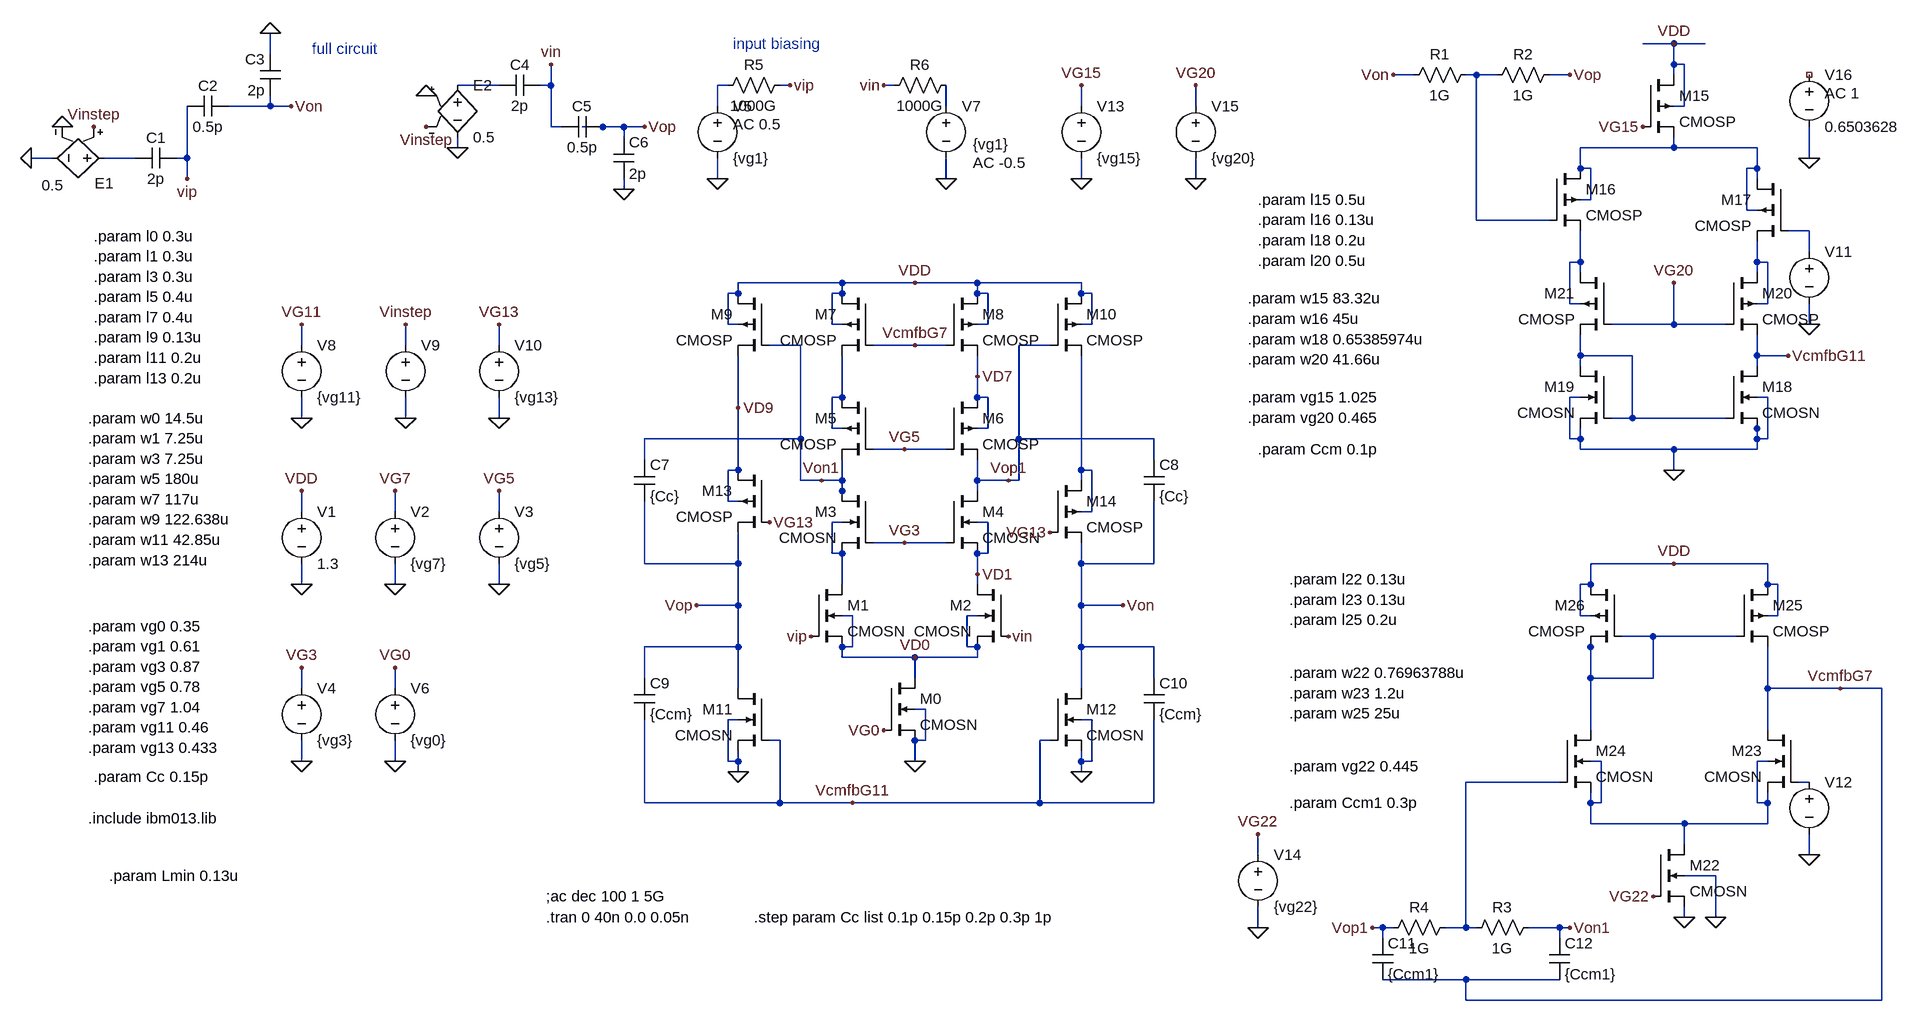
[diagram p0: schematic assignment5_final.asc]
assignment5_final.asc, the LTspice schematic file:
Version 4
SHEET 1 2248 764
WIRE 1360 -800 1312 -800
WIRE 1408 -800 1360 -800
WIRE -800 -784 -800 -816
WIRE 1360 -768 1360 -800
WIRE 1376 -768 1360 -768
WIRE 960 -752 928 -752
WIRE 1056 -752 1040 -752
WIRE 1088 -752 1056 -752
WIRE 1200 -752 1168 -752
WIRE 1360 -752 1360 -768
WIRE -448 -736 -512 -736
WIRE -368 -736 -368 -768
WIRE -368 -736 -384 -736
WIRE -96 -736 -112 -736
WIRE 0 -736 -16 -736
WIRE 160 -736 144 -736
WIRE -800 -704 -800 -720
WIRE -800 -704 -864 -704
WIRE -768 -704 -800 -704
WIRE -112 -704 -112 -736
WIRE 240 -704 240 -736
WIRE 448 -704 448 -736
WIRE 624 -704 624 -736
WIRE 1376 -704 1376 -768
WIRE 1376 -704 1360 -704
WIRE -368 -672 -368 -736
WIRE -352 -672 -368 -672
WIRE -288 -672 -320 -672
WIRE -256 -672 -288 -672
WIRE -224 -672 -256 -672
WIRE -256 -656 -256 -672
WIRE -512 -640 -512 -656
WIRE 1360 -640 1360 -656
WIRE 1360 -640 1216 -640
WIRE 1488 -640 1360 -640
WIRE -1136 -624 -1168 -624
WIRE -1008 -624 -1056 -624
WIRE -928 -624 -928 -704
WIRE -928 -624 -944 -624
WIRE 1568 -624 1568 -672
WIRE 1216 -608 1216 -640
WIRE 1232 -608 1216 -608
WIRE 1488 -608 1488 -640
WIRE 1488 -608 1472 -608
WIRE -928 -592 -928 -624
WIRE -112 -592 -112 -624
WIRE 240 -592 240 -624
WIRE 448 -592 448 -624
WIRE 624 -592 624 -624
WIRE 1488 -592 1488 -608
WIRE -256 -576 -256 -592
WIRE 1232 -560 1232 -608
WIRE 1232 -560 1216 -560
WIRE 1472 -544 1472 -608
WIRE 1488 -544 1472 -544
WIRE 1056 -528 1056 -752
WIRE 1168 -528 1056 -528
WIRE 1568 -512 1536 -512
WIRE 1568 -480 1568 -512
WIRE 1216 -464 1216 -512
WIRE 1216 -464 1200 -464
WIRE 1488 -464 1488 -496
WIRE 1504 -464 1488 -464
WIRE 1216 -448 1216 -464
WIRE 1488 -448 1488 -464
WIRE 80 -432 -80 -432
WIRE 192 -432 80 -432
WIRE 288 -432 192 -432
WIRE 448 -432 288 -432
WIRE -80 -416 -80 -432
WIRE -80 -416 -96 -416
WIRE 80 -416 80 -432
WIRE 80 -416 64 -416
WIRE 288 -416 288 -432
WIRE 304 -416 288 -416
WIRE 448 -416 448 -432
WIRE 464 -416 448 -416
WIRE 1200 -400 1200 -464
WIRE 1216 -400 1200 -400
WIRE 1504 -400 1504 -464
WIRE 1504 -400 1488 -400
WIRE -96 -368 -96 -416
WIRE -80 -368 -96 -368
WIRE 64 -368 64 -416
WIRE 80 -368 64 -368
WIRE 304 -368 304 -416
WIRE 304 -368 288 -368
WIRE 464 -368 464 -416
WIRE 464 -368 448 -368
WIRE 1360 -368 1360 -432
WIRE 1360 -368 1264 -368
WIRE 1440 -368 1360 -368
WIRE 1568 -368 1568 -400
WIRE -752 -336 -752 -368
WIRE -592 -336 -592 -368
WIRE -448 -336 -448 -368
WIRE 16 -336 -32 -336
WIRE 192 -336 128 -336
WIRE 240 -336 192 -336
WIRE 400 -336 352 -336
WIRE 1216 -320 1216 -352
WIRE 1296 -320 1216 -320
WIRE 1488 -320 1488 -352
WIRE 1536 -320 1488 -320
WIRE 1216 -304 1216 -320
WIRE 1488 -304 1488 -320
WIRE 288 -288 288 -320
WIRE 80 -256 80 -320
WIRE 80 -256 64 -256
WIRE 288 -256 288 -288
WIRE 304 -256 288 -256
WIRE 1216 -256 1200 -256
WIRE 1504 -256 1488 -256
WIRE -80 -240 -80 -320
WIRE -752 -224 -752 -256
WIRE -592 -224 -592 -256
WIRE -448 -224 -448 -256
WIRE 1296 -224 1296 -320
WIRE 1296 -224 1264 -224
WIRE 1440 -224 1296 -224
WIRE 64 -208 64 -256
WIRE 80 -208 64 -208
WIRE 304 -208 304 -256
WIRE 304 -208 288 -208
WIRE 1488 -208 1488 -224
WIRE 16 -192 16 -336
WIRE 16 -192 -224 -192
WIRE 352 -192 352 -336
WIRE 560 -192 352 -192
WIRE 1200 -192 1200 -256
WIRE 1216 -192 1216 -208
WIRE 1216 -192 1200 -192
WIRE 1488 -192 1488 -208
WIRE 1504 -192 1504 -256
WIRE 1504 -192 1488 -192
WIRE 176 -176 128 -176
WIRE 240 -176 176 -176
WIRE 1216 -176 1216 -192
WIRE 1360 -176 1216 -176
WIRE 1488 -176 1488 -192
WIRE 1488 -176 1360 -176
WIRE -224 -160 -224 -192
WIRE 560 -160 560 -192
WIRE -80 -144 -80 -240
WIRE -80 -144 -96 -144
WIRE 448 -144 448 -320
WIRE 464 -144 448 -144
WIRE 1360 -144 1360 -176
WIRE 16 -128 16 -192
WIRE 48 -128 16 -128
WIRE 80 -128 80 -160
WIRE 80 -128 48 -128
WIRE 288 -128 288 -160
WIRE 336 -128 288 -128
WIRE 352 -128 352 -192
WIRE 352 -128 336 -128
WIRE 448 -128 448 -144
WIRE 80 -112 80 -128
WIRE 288 -112 288 -128
WIRE -96 -96 -96 -144
WIRE -80 -96 -96 -96
WIRE 80 -96 80 -112
WIRE -752 -80 -752 -112
WIRE -608 -80 -608 -112
WIRE -448 -80 -448 -112
WIRE 464 -80 464 -144
WIRE 464 -80 448 -80
WIRE 80 -64 64 -64
WIRE 304 -64 288 -64
WIRE 176 -32 128 -32
WIRE 240 -32 176 -32
WIRE 64 -16 64 -64
WIRE 80 -16 64 -16
WIRE 304 -16 304 -64
WIRE 304 -16 288 -16
WIRE -224 0 -224 -96
WIRE -80 0 -80 -48
WIRE -80 0 -224 0
WIRE 448 0 448 -32
WIRE 560 0 560 -96
WIRE 560 0 448 0
WIRE 1360 0 1232 0
WIRE 1504 0 1360 0
WIRE 288 16 288 -16
WIRE -752 32 -752 0
WIRE -608 32 -608 0
WIRE -448 32 -448 0
WIRE 80 32 80 -16
WIRE 288 32 288 16
WIRE 1232 32 1232 0
WIRE 1232 32 1216 32
WIRE 1504 32 1504 0
WIRE 1520 32 1504 32
WIRE -80 64 -80 0
WIRE -80 64 -144 64
WIRE 448 64 448 0
WIRE 512 64 448 64
WIRE 96 80 80 80
WIRE 288 80 272 80
WIRE 1216 80 1216 32
WIRE 1232 80 1216 80
WIRE 1520 80 1520 32
WIRE 1520 80 1504 80
WIRE 1328 112 1280 112
WIRE 1456 112 1328 112
WIRE -80 128 -80 64
WIRE -80 128 -224 128
WIRE 96 128 96 80
WIRE 96 128 80 128
WIRE 272 128 272 80
WIRE 288 128 272 128
WIRE 448 128 448 64
WIRE 560 128 448 128
WIRE 1232 128 1232 112
WIRE 80 144 80 128
WIRE 192 144 80 144
WIRE 288 144 288 128
WIRE 288 144 192 144
WIRE -224 176 -224 128
WIRE 192 176 192 144
WIRE 560 176 560 128
WIRE 1232 176 1232 128
WIRE 1328 176 1328 112
WIRE 1328 176 1232 176
WIRE -752 192 -752 160
WIRE -608 192 -608 160
WIRE -80 192 -80 128
WIRE 448 192 448 128
WIRE 1504 192 1504 128
WIRE 1616 192 1504 192
WIRE 1680 192 1616 192
WIRE 208 224 192 224
WIRE -80 240 -96 240
WIRE 464 240 448 240
WIRE 1232 256 1232 176
WIRE 1504 256 1504 192
WIRE -16 272 -32 272
WIRE 208 272 208 224
WIRE 208 272 192 272
WIRE 400 272 384 272
WIRE -752 304 -752 272
WIRE -608 304 -608 272
WIRE -96 304 -96 240
WIRE -80 304 -80 288
WIRE -80 304 -96 304
WIRE 192 304 192 272
WIRE 448 304 448 288
WIRE 464 304 464 240
WIRE 464 304 448 304
WIRE 1248 304 1232 304
WIRE 1504 304 1488 304
WIRE -80 320 -80 304
WIRE 448 320 448 304
WIRE 1184 336 1040 336
WIRE 1568 336 1552 336
WIRE -224 368 -224 240
WIRE -16 368 -16 272
WIRE -16 368 -224 368
WIRE 96 368 -16 368
WIRE 384 368 384 272
WIRE 384 368 96 368
WIRE 560 368 560 240
WIRE 560 368 384 368
WIRE 1232 368 1232 352
WIRE 1248 368 1248 304
WIRE 1248 368 1232 368
WIRE 1488 368 1488 304
WIRE 1504 368 1504 352
WIRE 1504 368 1488 368
WIRE 1232 400 1232 368
WIRE 1376 400 1232 400
WIRE 1504 400 1504 368
WIRE 1504 400 1376 400
WIRE 1376 432 1376 400
WIRE 720 448 720 416
WIRE 1568 448 1568 416
WIRE 1424 480 1376 480
WIRE 1376 544 1376 528
WIRE 1424 544 1424 480
WIRE 720 560 720 528
WIRE 912 560 896 560
WIRE 928 560 912 560
WIRE 1040 560 1040 336
WIRE 1040 560 1008 560
WIRE 1056 560 1040 560
WIRE 1184 560 1136 560
WIRE 1200 560 1184 560
WIRE 912 576 912 560
WIRE 1184 576 1184 560
WIRE 1040 640 912 640
WIRE 1184 640 1040 640
WIRE 1040 672 1040 640
WIRE 1680 672 1680 192
WIRE 1680 672 1040 672
FLAG 192 304 0
FLAG -752 32 0
FLAG -752 -112 VDD
FLAG -608 32 0
FLAG -608 -112 VG7
FLAG -448 32 0
FLAG -448 -112 VG5
FLAG -752 304 0
FLAG -752 160 VG3
FLAG -112 -592 0
FLAG -608 304 0
FLAG -608 160 VG0
FLAG 192 -432 VDD
FLAG 192 -336 VcmfbG7
FLAG 176 -176 VG5
FLAG 176 -32 VG3
FLAG 32 112 vip
FLAG 336 112 vin
FLAG 144 256 VG0
FLAG 48 -128 Von1
FLAG 336 -128 Vop1
FLAG 240 -592 0
FLAG -800 -816 0
FLAG -256 -576 0
FLAG -768 -704 Von
FLAG -224 -672 Vop
FLAG 0 -736 vip
FLAG 144 -736 vin
FLAG -928 -592 vip
FLAG -368 -768 vin
FLAG -752 -224 0
FLAG -752 -368 VG11
FLAG -512 -640 0
FLAG -1168 -624 0
FLAG -592 -224 0
FLAG -592 -368 Vinstep
FLAG -1120 -672 0
FLAG -1072 -672 Vinstep
FLAG -560 -720 0
FLAG -560 -672 Vinstep
FLAG -80 320 0
FLAG 448 320 0
FLAG 96 368 VcmfbG11
FLAG 288 -288 VD7
FLAG 288 16 VD1
FLAG 192 144 VD0
FLAG -448 -224 0
FLAG -448 -368 VG13
FLAG -32 -64 VG13
FLAG 400 -48 VG13
FLAG 512 64 Von
FLAG -144 64 Vop
FLAG -80 -240 VD9
FLAG 1360 -800 VDD
FLAG 1360 -144 0
FLAG 1568 -368 0
FLAG 448 -592 0
FLAG 448 -736 VG15
FLAG 624 -592 0
FLAG 624 -736 VG20
FLAG 1360 -432 VG20
FLAG 1312 -672 VG15
FLAG 1536 -320 VcmfbG11
FLAG 928 -752 Von
FLAG 1200 -752 Vop
FLAG 1376 544 0
FLAG 1424 544 0
FLAG 1360 0 VDD
FLAG 1200 560 Von1
FLAG 896 560 Vop1
FLAG 1568 448 0
FLAG 1616 192 VcmfbG7
FLAG 720 560 0
FLAG 720 416 VG22
FLAG 1328 512 VG22
FLAG 1568 -624 0
DATAFLAG -208 0 ""
DATAFLAG 352 -304 ""
DATAFLAG 272 368 ""
DATAFLAG 1360 400 ""
SYMBOL cmosn 32 32 R0
SYMATTR InstName M1
SYMATTR Value2 l={l1} w={w1} ad={2*Lmin*w1} as={2*Lmin*w1} pd={2*w1+4*Lmin} ps={2*w1+4*Lmin}
SYMBOL cmosn 336 32 M0
SYMATTR InstName M2
SYMATTR Value2 l={l1} w={w1} ad={2*Lmin*w1} as={2*Lmin*w1} pd={2*w1+4*Lmin} ps={2*w1+4*Lmin}
SYMBOL cmosn 128 -112 M0
SYMATTR InstName M3
SYMATTR Value2 l={l3} w={w3} ad={2*Lmin*w3} as={2*Lmin*w3} pd={2*w3+4*Lmin} ps={2*w3+4*Lmin}
SYMBOL cmosn 240 -112 R0
SYMATTR InstName M4
SYMATTR Value2 l={l3} w={w3} ad={2*Lmin*w3} as={2*Lmin*w3} pd={2*w3+4*Lmin} ps={2*w3+4*Lmin}
SYMBOL cmosp 128 -256 M0
SYMATTR InstName M5
SYMATTR Value2 l={l5} w={w5} ad={2*Lmin*w5} as={2*Lmin*w5} pd={2*w5+4*Lmin} ps={2*w5+4*Lmin}
SYMBOL cmosp 240 -256 R0
SYMATTR InstName M6
SYMATTR Value2 l={l5} w={w5} ad={2*Lmin*w5} as={2*Lmin*w5} pd={2*w5+4*Lmin} ps={2*w5+4*Lmin}
SYMBOL cmosp 128 -416 M0
SYMATTR InstName M7
SYMATTR Value2 l={l7} w={w7} ad={2*Lmin*w7} as={2*Lmin*w7} pd={2*w7+4*Lmin} ps={2*w7+4*Lmin}
SYMBOL cmosp 240 -416 R0
SYMATTR InstName M8
SYMATTR Value2 l={l7} w={w7} ad={2*Lmin*w7} as={2*Lmin*w7} pd={2*w7+4*Lmin} ps={2*w7+4*Lmin}
SYMBOL cmosn 144 176 R0
SYMATTR InstName M0
SYMATTR Value2 l={l0} w={w0} ad={2*Lmin*w0} as={2*Lmin*w0} pd={2*w0+4*Lmin} ps={2*w0+4*Lmin}
SYMBOL voltage -752 -96 R0
WINDOW 123 0 0 Left 0
WINDOW 39 0 0 Left 0
SYMATTR InstName V1
SYMATTR Value 1.3
SYMBOL voltage -608 -96 R0
WINDOW 123 24 44 Left 2
WINDOW 39 0 0 Left 0
SYMATTR InstName V2
SYMATTR Value {vg7}
SYMBOL voltage -448 -96 R0
WINDOW 123 0 0 Left 0
WINDOW 39 0 0 Left 0
SYMATTR InstName V3
SYMATTR Value {vg5}
SYMBOL voltage -752 176 R0
WINDOW 123 0 0 Left 0
WINDOW 39 0 0 Left 0
SYMATTR InstName V4
SYMATTR Value {vg3}
SYMBOL voltage -112 -720 R0
WINDOW 123 24 44 Left 2
WINDOW 39 24 44 Left 2
SYMATTR Value2 AC 0.5
SYMATTR InstName V5
SYMATTR Value {vg1}
SYMBOL voltage -608 176 R0
WINDOW 123 24 124 Left 2
WINDOW 39 0 0 Left 0
SYMATTR InstName V6
SYMATTR Value {vg0}
SYMBOL voltage 240 -720 R0
WINDOW 123 41 103 Left 2
WINDOW 39 0 0 Left 0
WINDOW 3 41 75 Left 2
SYMATTR Value2 AC -0.5
SYMATTR Value {vg1}
SYMATTR InstName V7
SYMBOL cap -944 -640 R90
WINDOW 0 0 32 VBottom 2
WINDOW 3 32 32 VTop 2
SYMATTR InstName C1
SYMATTR Value 2p
SYMBOL cap -864 -720 R90
WINDOW 0 0 32 VBottom 2
WINDOW 3 32 32 VTop 2
SYMATTR InstName C2
SYMATTR Value 0.5p
SYMBOL cap -784 -720 R180
WINDOW 0 24 56 Left 2
WINDOW 3 24 8 Left 2
SYMATTR InstName C3
SYMATTR Value 2p
SYMBOL cap -448 -720 R270
WINDOW 0 32 32 VTop 2
WINDOW 3 0 32 VBottom 2
SYMATTR InstName C4
SYMATTR Value 2p
SYMBOL cap -352 -656 R270
WINDOW 0 32 32 VTop 2
WINDOW 3 0 32 VBottom 2
SYMATTR InstName C5
SYMATTR Value 0.5p
SYMBOL cap -272 -656 R0
SYMATTR InstName C6
SYMATTR Value 2p
SYMBOL voltage -752 -352 R0
WINDOW 123 24 44 Left 2
WINDOW 39 0 0 Left 0
SYMATTR InstName V8
SYMATTR Value {vg11}
SYMBOL e -1040 -624 R90
WINDOW 0 39 1 VRight 2
WINDOW 3 42 78 VRight 2
SYMATTR InstName E1
SYMATTR Value 0.5
SYMBOL e -512 -752 R0
SYMATTR InstName E2
SYMATTR Value 0.5
SYMBOL voltage -592 -352 R0
WINDOW 123 0 0 Left 0
WINDOW 39 0 0 Left 0
WINDOW 3 24 96 Invisible 2
SYMATTR Value PULSE(0 0.1 1f 1f 1f 10 9.999999999 10)
SYMATTR InstName V9
SYMBOL cmosp 400 -416 R0
SYMATTR InstName M10
SYMATTR Value2 l={l9} w={w9} ad={2*Lmin*w9} as={2*Lmin*w9} pd={2*w9+4*Lmin} ps={2*w9+4*Lmin}
SYMBOL cmosp -32 -416 M0
SYMATTR InstName M9
SYMATTR Value2 l={l9} w={w9} ad={2*Lmin*w9} as={2*Lmin*w9} pd={2*w9+4*Lmin} ps={2*w9+4*Lmin}
SYMBOL cmosn 400 192 R0
SYMATTR InstName M12
SYMATTR Value2 l={l11} w={w11} ad={2*Lmin*w11} as={2*Lmin*w11} pd={2*w11+4*Lmin} ps={2*w11+4*Lmin}
SYMBOL cmosn -32 192 M0
SYMATTR InstName M11
SYMATTR Value2 l={l11} w={w11} ad={2*Lmin*w11} as={2*Lmin*w11} pd={2*w11+4*Lmin} ps={2*w11+4*Lmin}
SYMBOL cmosp -32 -144 M0
SYMATTR InstName M13
SYMATTR Value2 l={l13} w={w13} ad={2*Lmin*w13} as={2*Lmin*w13} pd={2*w13+4*Lmin} ps={2*w13+4*Lmin}
SYMBOL cmosp 400 -128 R0
SYMATTR InstName M14
SYMATTR Value2 l={l13} w={w13} ad={2*Lmin*w13} as={2*Lmin*w13} pd={2*w13+4*Lmin} ps={2*w13+4*Lmin}
SYMBOL voltage -448 -352 R0
WINDOW 123 0 0 Left 0
WINDOW 39 0 0 Left 0
SYMATTR InstName V10
SYMATTR Value {vg13}
SYMBOL cap -240 -160 R0
SYMATTR InstName C7
SYMATTR Value {Cc}
SYMBOL cap 544 -160 R0
SYMATTR InstName C8
SYMATTR Value {Cc}
SYMBOL cmosp 1312 -752 R0
SYMATTR InstName M15
SYMATTR Value2 l={l15} w={w15} ad={2*Lmin*w15} as={2*Lmin*w15} pd={2*w15+4*Lmin} ps={2*w15+4*Lmin}
SYMBOL cmosp 1168 -608 R0
SYMATTR InstName M16
SYMATTR Value2 l={l16} w={w16} ad={2*Lmin*w16} as={2*Lmin*w16} pd={2*w16+4*Lmin} ps={2*w16+4*Lmin}
SYMBOL cmosp 1536 -592 M0
SYMATTR InstName M17
SYMATTR Value2 l={l16} w={w16} ad={2*Lmin*w16} as={2*Lmin*w16} pd={2*w16+4*Lmin} ps={2*w16+4*Lmin}
SYMBOL cmosn 1440 -304 R0
SYMATTR InstName M18
SYMATTR Value2 l={l18} w={w18} ad={2*Lmin*w18} as={2*Lmin*w18} pd={2*w18+4*Lmin} ps={2*w18+4*Lmin}
SYMBOL cmosn 1264 -304 M0
SYMATTR InstName M19
SYMATTR Value2 l={l18} w={w18} ad={2*Lmin*w18} as={2*Lmin*w18} pd={2*w18+4*Lmin} ps={2*w18+4*Lmin}
SYMBOL voltage 1568 -496 R0
WINDOW 123 0 0 Left 0
WINDOW 39 0 0 Left 0
WINDOW 3 24 96 Invisible 2
SYMATTR Value 0.6503628
SYMATTR InstName V11
SYMBOL voltage 448 -720 R0
WINDOW 123 0 0 Left 0
WINDOW 39 0 0 Left 0
SYMATTR InstName V13
SYMATTR Value {vg15}
SYMBOL cmosp 1440 -448 R0
SYMATTR InstName M20
SYMATTR Value2 l={l20} w={w20} ad={2*Lmin*w20} as={2*Lmin*w20} pd={2*w20+4*Lmin} ps={2*w20+4*Lmin}
SYMBOL cmosp 1264 -448 M0
SYMATTR InstName M21
SYMATTR Value2 l={l20} w={w20} ad={2*Lmin*w20} as={2*Lmin*w20} pd={2*w20+4*Lmin} ps={2*w20+4*Lmin}
SYMBOL voltage 624 -720 R0
WINDOW 123 0 0 Left 0
WINDOW 39 0 0 Left 0
SYMATTR InstName V15
SYMATTR Value {vg20}
SYMBOL res 1056 -768 R90
WINDOW 0 0 56 VBottom 2
WINDOW 3 32 56 VTop 2
SYMATTR InstName R1
SYMATTR Value 1G
SYMBOL res 1184 -768 R90
WINDOW 0 0 56 VBottom 2
WINDOW 3 32 56 VTop 2
SYMATTR InstName R2
SYMATTR Value 1G
SYMBOL cap -240 176 R0
SYMATTR InstName C9
SYMATTR Value {Ccm}
SYMBOL cap 544 176 R0
SYMATTR InstName C10
SYMATTR Value {Ccm}
SYMBOL cmosn 1328 432 R0
SYMATTR InstName M22
SYMATTR Value2 l={l22} w={w22} ad={2*Lmin*w22} as={2*Lmin*w22} pd={2*w22+4*Lmin} ps={2*w22+4*Lmin}
SYMBOL cmosn 1552 256 M0
SYMATTR InstName M23
SYMATTR Value2 l={l25} w={w23} ad={2*Lmin*w23} as={2*Lmin*w23} pd={2*w23+4*Lmin} ps={2*w23+4*Lmin}
SYMBOL cmosn 1184 256 R0
SYMATTR InstName M24
SYMATTR Value2 l={l25} w={w23} ad={2*Lmin*w23} as={2*Lmin*w23} pd={2*w23+4*Lmin} ps={2*w23+4*Lmin}
SYMBOL cmosp 1456 32 R0
SYMATTR InstName M25
SYMATTR Value2 l={l25} w={w25} ad={2*Lmin*w25} as={2*Lmin*w25} pd={2*w25+4*Lmin} ps={2*w25+4*Lmin}
SYMBOL cmosp 1280 32 M0
SYMATTR InstName M26
SYMATTR Value2 l={l25} w={w25} ad={2*Lmin*w25} as={2*Lmin*w25} pd={2*w25+4*Lmin} ps={2*w25+4*Lmin}
SYMBOL res 1040 576 R270
WINDOW 0 32 56 VTop 2
WINDOW 3 0 56 VBottom 2
SYMATTR InstName R3
SYMATTR Value 1G
SYMBOL res 912 576 R270
WINDOW 0 32 56 VTop 2
WINDOW 3 0 56 VBottom 2
SYMATTR InstName R4
SYMATTR Value 1G
SYMBOL voltage 1568 320 R0
WINDOW 123 0 0 Left 0
WINDOW 39 0 0 Left 0
WINDOW 3 24 96 Invisible 2
SYMATTR Value 0.7839377
SYMATTR InstName V12
SYMBOL voltage 720 432 R0
WINDOW 123 0 0 Left 0
WINDOW 39 0 0 Left 0
SYMATTR InstName V14
SYMATTR Value {vg22}
SYMBOL voltage 1568 -768 R0
WINDOW 123 24 44 Left 2
WINDOW 39 0 0 Left 0
SYMATTR Value2 AC 1
SYMATTR InstName V16
SYMATTR Value 0.6503628
SYMBOL cap 896 576 R0
SYMATTR InstName C11
SYMATTR Value {Ccm1}
SYMBOL cap 1168 576 R0
SYMATTR InstName C12
SYMATTR Value {Ccm1}
SYMBOL res 0 -752 R90
WINDOW 0 0 56 VBottom 2
WINDOW 3 32 56 VTop 2
SYMATTR InstName R5
SYMATTR Value 1000G
SYMBOL res 256 -752 R90
WINDOW 0 0 56 VBottom 2
WINDOW 3 32 56 VTop 2
SYMATTR InstName R6
SYMATTR Value 1000G
TEXT -1080 -224 Left 2 !.param w0 14.5u\n.param w1 7.25u\n.param w3 7.25u\n.param w5 180u\n.param w7 117u\n.param w9 122.638u\n.param w11 42.85u\n.param w13 214u
TEXT -1080 96 Left 2 !.param vg0 0.35\n.param vg1 0.61\n.param vg3 0.87\n.param vg5 0.78\n.param vg7 1.04\n.param vg11 0.46\n.param vg13 0.433
TEXT -376 512 Left 2 !;ac dec 100 1 5G
TEXT -1080 392 Left 2 !.include ibm013.lib
TEXT -376 544 Left 2 !.tran 0 40n 0.0 0.05n
TEXT -88 -800 Left 2 ;input biasing
TEXT -1072 328 Left 2 !.param Cc 0.15p
TEXT -1048 480 Left 2 !.param Lmin 0.13u
TEXT -1072 -504 Left 2 !.param l0 0.3u\n.param l1 0.3u\n.param l3 0.3u\n.param l5 0.4u\n.param l7 0.4u\n.param l9 0.13u\n.param l11 0.2u\n.param l13 0.2u
TEXT -736 -792 Left 2 ;full circuit
TEXT 720 -560 Left 2 !.param l15 0.5u\n.param l16 0.13u\n.param l18 0.2u\n.param l20 0.5u
TEXT 704 -408 Left 2 !.param w15 83.32u\n.param w16 45u\n.param w18 0.65385974u\n.param w20 41.66u
TEXT 704 -256 Left 2 !.param vg15 1.025\n.param vg20 0.465
TEXT 720 -176 Left 2 !.param Ccm 0.1p
TEXT 768 24 Left 2 !.param l22 0.13u\n.param l23 0.13u\n.param l25 0.2u
TEXT 768 168 Left 2 !.param w22 0.76963788u\n.param w23 1.2u\n.param w25 25u
TEXT 768 312 Left 2 !.param vg22 0.445
TEXT 768 368 Left 2 !.param Ccm1 0.3p
TEXT -56 544 Left 2 !.step param Cc list 0.1p 0.15p 0.2p 0.3p 1p

The netlist it stands for:
* assignment5_final.asc
M1 N013 vip VD0 VD0 CMOSN l={l1} w={w1} ad={2*Lmin*w1} as={2*Lmin*w1} pd={2*w1+4*Lmin} ps={2*w1+4*Lmin}
M2 VD1 vin VD0 VD0 CMOSN l={l1} w={w1} ad={2*Lmin*w1} as={2*Lmin*w1} pd={2*w1+4*Lmin} ps={2*w1+4*Lmin}
M3 Von1 VG3 N013 N013 CMOSN l={l3} w={w3} ad={2*Lmin*w3} as={2*Lmin*w3} pd={2*w3+4*Lmin} ps={2*w3+4*Lmin}
M4 Vop1 VG3 VD1 VD1 CMOSN l={l3} w={w3} ad={2*Lmin*w3} as={2*Lmin*w3} pd={2*w3+4*Lmin} ps={2*w3+4*Lmin}
M5 N011 VG5 Von1 N011 CMOSP l={l5} w={w5} ad={2*Lmin*w5} as={2*Lmin*w5} pd={2*w5+4*Lmin} ps={2*w5+4*Lmin}
M6 VD7 VG5 Vop1 VD7 CMOSP l={l5} w={w5} ad={2*Lmin*w5} as={2*Lmin*w5} pd={2*w5+4*Lmin} ps={2*w5+4*Lmin}
M7 VDD VcmfbG7 N011 VDD CMOSP l={l7} w={w7} ad={2*Lmin*w7} as={2*Lmin*w7} pd={2*w7+4*Lmin} ps={2*w7+4*Lmin}
M8 VDD VcmfbG7 VD7 VDD CMOSP l={l7} w={w7} ad={2*Lmin*w7} as={2*Lmin*w7} pd={2*w7+4*Lmin} ps={2*w7+4*Lmin}
M0 VD0 VG0 0 0 CMOSN l={l0} w={w0} ad={2*Lmin*w0} as={2*Lmin*w0} pd={2*w0+4*Lmin} ps={2*w0+4*Lmin}
V1 VDD 0 1.3
V2 VG7 0 {vg7}
V3 VG5 0 {vg5}
V4 VG3 0 {vg3}
V5 N003 0 {vg1} AC 0.5
V6 VG0 0 {vg0}
V7 N004 0 {vg1} AC -0.5
C1 vip N006 2p
C2 Von vip 0.5p
C3 Von 0 2p
C4 N002 vin 2p
C5 vin Vop 0.5p
C6 Vop 0 2p
V8 VG11 0 {vg11}
E1 N006 0 Vinstep 0 0.5
E2 N002 0 0 Vinstep 0.5
V9 Vinstep 0 PULSE(0 0.1 1f 1f 1f 10 9.999999999 10)
M10 VDD Vop1 N012 VDD CMOSP l={l9} w={w9} ad={2*Lmin*w9} as={2*Lmin*w9} pd={2*w9+4*Lmin} ps={2*w9+4*Lmin}
M9 VDD Von1 VD9 VDD CMOSP l={l9} w={w9} ad={2*Lmin*w9} as={2*Lmin*w9} pd={2*w9+4*Lmin} ps={2*w9+4*Lmin}
M12 Von VcmfbG11 0 0 CMOSN l={l11} w={w11} ad={2*Lmin*w11} as={2*Lmin*w11} pd={2*w11+4*Lmin} ps={2*w11+4*Lmin}
M11 Vop VcmfbG11 0 0 CMOSN l={l11} w={w11} ad={2*Lmin*w11} as={2*Lmin*w11} pd={2*w11+4*Lmin} ps={2*w11+4*Lmin}
M13 VD9 VG13 Vop VD9 CMOSP l={l13} w={w13} ad={2*Lmin*w13} as={2*Lmin*w13} pd={2*w13+4*Lmin} ps={2*w13+4*Lmin}
M14 N012 VG13 Von N012 CMOSP l={l13} w={w13} ad={2*Lmin*w13} as={2*Lmin*w13} pd={2*w13+4*Lmin} ps={2*w13+4*Lmin}
V10 VG13 0 {vg13}
C7 Von1 Vop {Cc}
C8 Vop1 Von {Cc}
M15 VDD VG15 N005 VDD CMOSP l={l15} w={w15} ad={2*Lmin*w15} as={2*Lmin*w15} pd={2*w15+4*Lmin} ps={2*w15+4*Lmin}
M16 N005 N001 N008 N005 CMOSP l={l16} w={w16} ad={2*Lmin*w16} as={2*Lmin*w16} pd={2*w16+4*Lmin} ps={2*w16+4*Lmin}
M17 N005 N007 N009 N005 CMOSP l={l16} w={w16} ad={2*Lmin*w16} as={2*Lmin*w16} pd={2*w16+4*Lmin} ps={2*w16+4*Lmin}
M18 VcmfbG11 N010 0 0 CMOSN l={l18} w={w18} ad={2*Lmin*w18} as={2*Lmin*w18} pd={2*w18+4*Lmin} ps={2*w18+4*Lmin}
M19 N010 N010 0 0 CMOSN l={l18} w={w18} ad={2*Lmin*w18} as={2*Lmin*w18} pd={2*w18+4*Lmin} ps={2*w18+4*Lmin}
V11 N007 0 0.6503628
V13 VG15 0 {vg15}
M20 N009 VG20 VcmfbG11 N009 CMOSP l={l20} w={w20} ad={2*Lmin*w20} as={2*Lmin*w20} pd={2*w20+4*Lmin} ps={2*w20+4*Lmin}
M21 N008 VG20 N010 N008 CMOSP l={l20} w={w20} ad={2*Lmin*w20} as={2*Lmin*w20} pd={2*w20+4*Lmin} ps={2*w20+4*Lmin}
V15 VG20 0 {vg20}
R1 N001 Von 1G
R2 Vop N001 1G
C9 Vop VcmfbG11 {Ccm}
C10 Von VcmfbG11 {Ccm}
M22 N015 VG22 0 0 CMOSN l={l22} w={w22} ad={2*Lmin*w22} as={2*Lmin*w22} pd={2*w22+4*Lmin} ps={2*w22+4*Lmin}
M23 VcmfbG7 N017 N015 N015 CMOSN l={l25} w={w23} ad={2*Lmin*w23} as={2*Lmin*w23} pd={2*w23+4*Lmin} ps={2*w23+4*Lmin}
M24 N014 N016 N015 N015 CMOSN l={l25} w={w23} ad={2*Lmin*w23} as={2*Lmin*w23} pd={2*w23+4*Lmin} ps={2*w23+4*Lmin}
M25 VDD N014 VcmfbG7 VDD CMOSP l={l25} w={w25} ad={2*Lmin*w25} as={2*Lmin*w25} pd={2*w25+4*Lmin} ps={2*w25+4*Lmin}
M26 VDD N014 N014 VDD CMOSP l={l25} w={w25} ad={2*Lmin*w25} as={2*Lmin*w25} pd={2*w25+4*Lmin} ps={2*w25+4*Lmin}
R3 N016 Von1 1G
R4 Vop1 N016 1G
V12 N017 0 0.7839377
V14 VG22 0 {vg22}
V16 NC_01 0 0.6503628 AC 1
C11 Vop1 VcmfbG7 {Ccm1}
C12 Von1 VcmfbG7 {Ccm1}
R5 vip N003 1000G
R6 N004 vin 1000G
.model NMOS NMOS
.model PMOS PMOS
.lib standard.mos
.param w0 14.5u
.param w1 7.25u
.param w3 7.25u
.param w5 180u
.param w7 117u
.param w9 122.638u
.param w11 42.85u
.param w13 214u
.param vg0 0.35
.param vg1 0.61
.param vg3 0.87
.param vg5 0.78
.param vg7 1.04
.param vg11 0.46
.param vg13 0.433
;ac dec 100 1 5G
.include ibm013.lib
.tran 0 40n 0.0 0.05n
* input biasing
.param Cc 0.15p
.param Lmin 0.13u
.param l0 0.3u
.param l1 0.3u
.param l3 0.3u
.param l5 0.4u
.param l7 0.4u
.param l9 0.13u
.param l11 0.2u
.param l13 0.2u
* full circuit
.param l15 0.5u
.param l16 0.13u
.param l18 0.2u
.param l20 0.5u
.param w15 83.32u
.param w16 45u
.param w18 0.65385974u
.param w20 41.66u
.param vg15 1.025
.param vg20 0.465
.param Ccm 0.1p
.param l22 0.13u
.param l23 0.13u
.param l25 0.2u
.param w22 0.76963788u
.param w23 1.2u
.param w25 25u
.param vg22 0.445
.param Ccm1 0.3p
.step param Cc list 0.1p 0.15p 0.2p 0.3p 1p
.backanno
.end